# Altium schematic sheet AMP_P2.SchDoc
size A; SheetNumber: 5; SheetTotal: 6
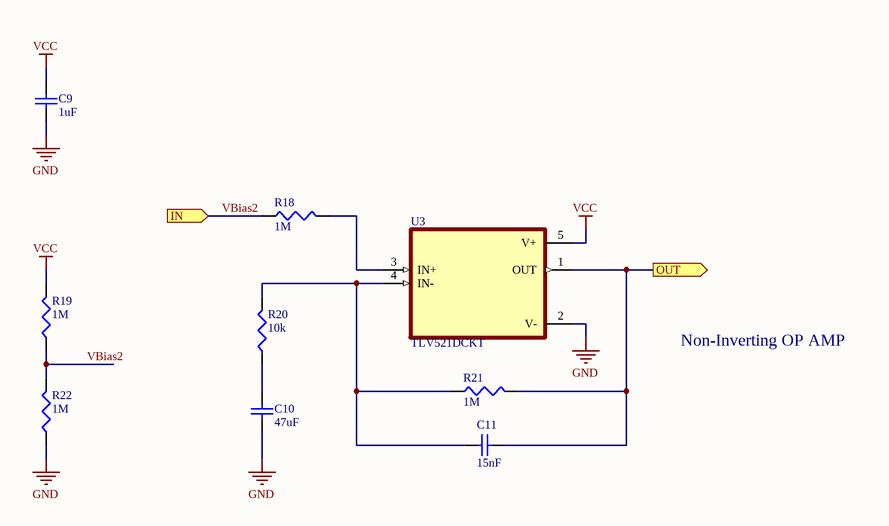
[diagram p0: AMP_P2.SchDoc]

## Parts
C9  1uF  [SMD-0603]
C10  47uF  [SMD-0603]
C11  15nF  [SMD-0603]
R18  1M  [SMD-0603]
R19  1M  [SMD-0603]
R20  10k  [SMD-0603]
R21  1M  [SMD-0603]
R22  1M  [SMD-0603]
U3  TLV521DCKT  [TLV521-SOT-5N]

## Ports
IN (in), OUT (out)

## Nets
GND: C9.1 C10.1 R22.1 U3.2(V-)
VCC: C9.2 R19.2 U3.5(V+)
OUT: C11.2 R21.2 U3.1(OUT) ; port OUT
VBias2: R18.1 R19.1 R22.2 ; port IN
NetC10_2: C10.2 R20.1
NetC11_1: C11.1 R20.2 R21.1 U3.4(IN-)
NetR18_2: R18.2 U3.3(IN+)

## Notes on the sheet
- Non-Inverting OP AMP

## Library data of the parts
C9-C11 = CAP0603: Ceramic Capacitor 0603
R18-R22 = RES0603: Resistor-0603
U3 = TLV521DCKT: 350-nA Nanopower, Single, RRIO, CMOS Input, Operational Amplifier for Cost-Sensitive Systems 5-SC70 -40 to 125; MF: Texas Instruments; DigiKey-Purchase-URL: https://snapeda.com/shop?store=DigiKey&id=809196; Package: SOT-SC70-5 Texas Instruments; Mouser-Purchase-URL: https://snapeda.com/shop?store=Mouser&id=809196; Value: *; Arrow_Electronics-Purchase-URL: https://snapeda.com/shop?store=Arrow+Electronics&id=809196; Texas_Instruments-Purchase-URL: https://snapeda.com/shop?store=Texas+Instruments&id=809196; SnapEDA_Link: https://www.snapeda.com/parts/TLV521DCKT/Texas%20Instruments/view-part/809196/?ref=snap; Availability: Unavailable; Price: None; MP: TLV521DCKT